# Altium schematic sheet main.SchDoc (part 3 of 3)
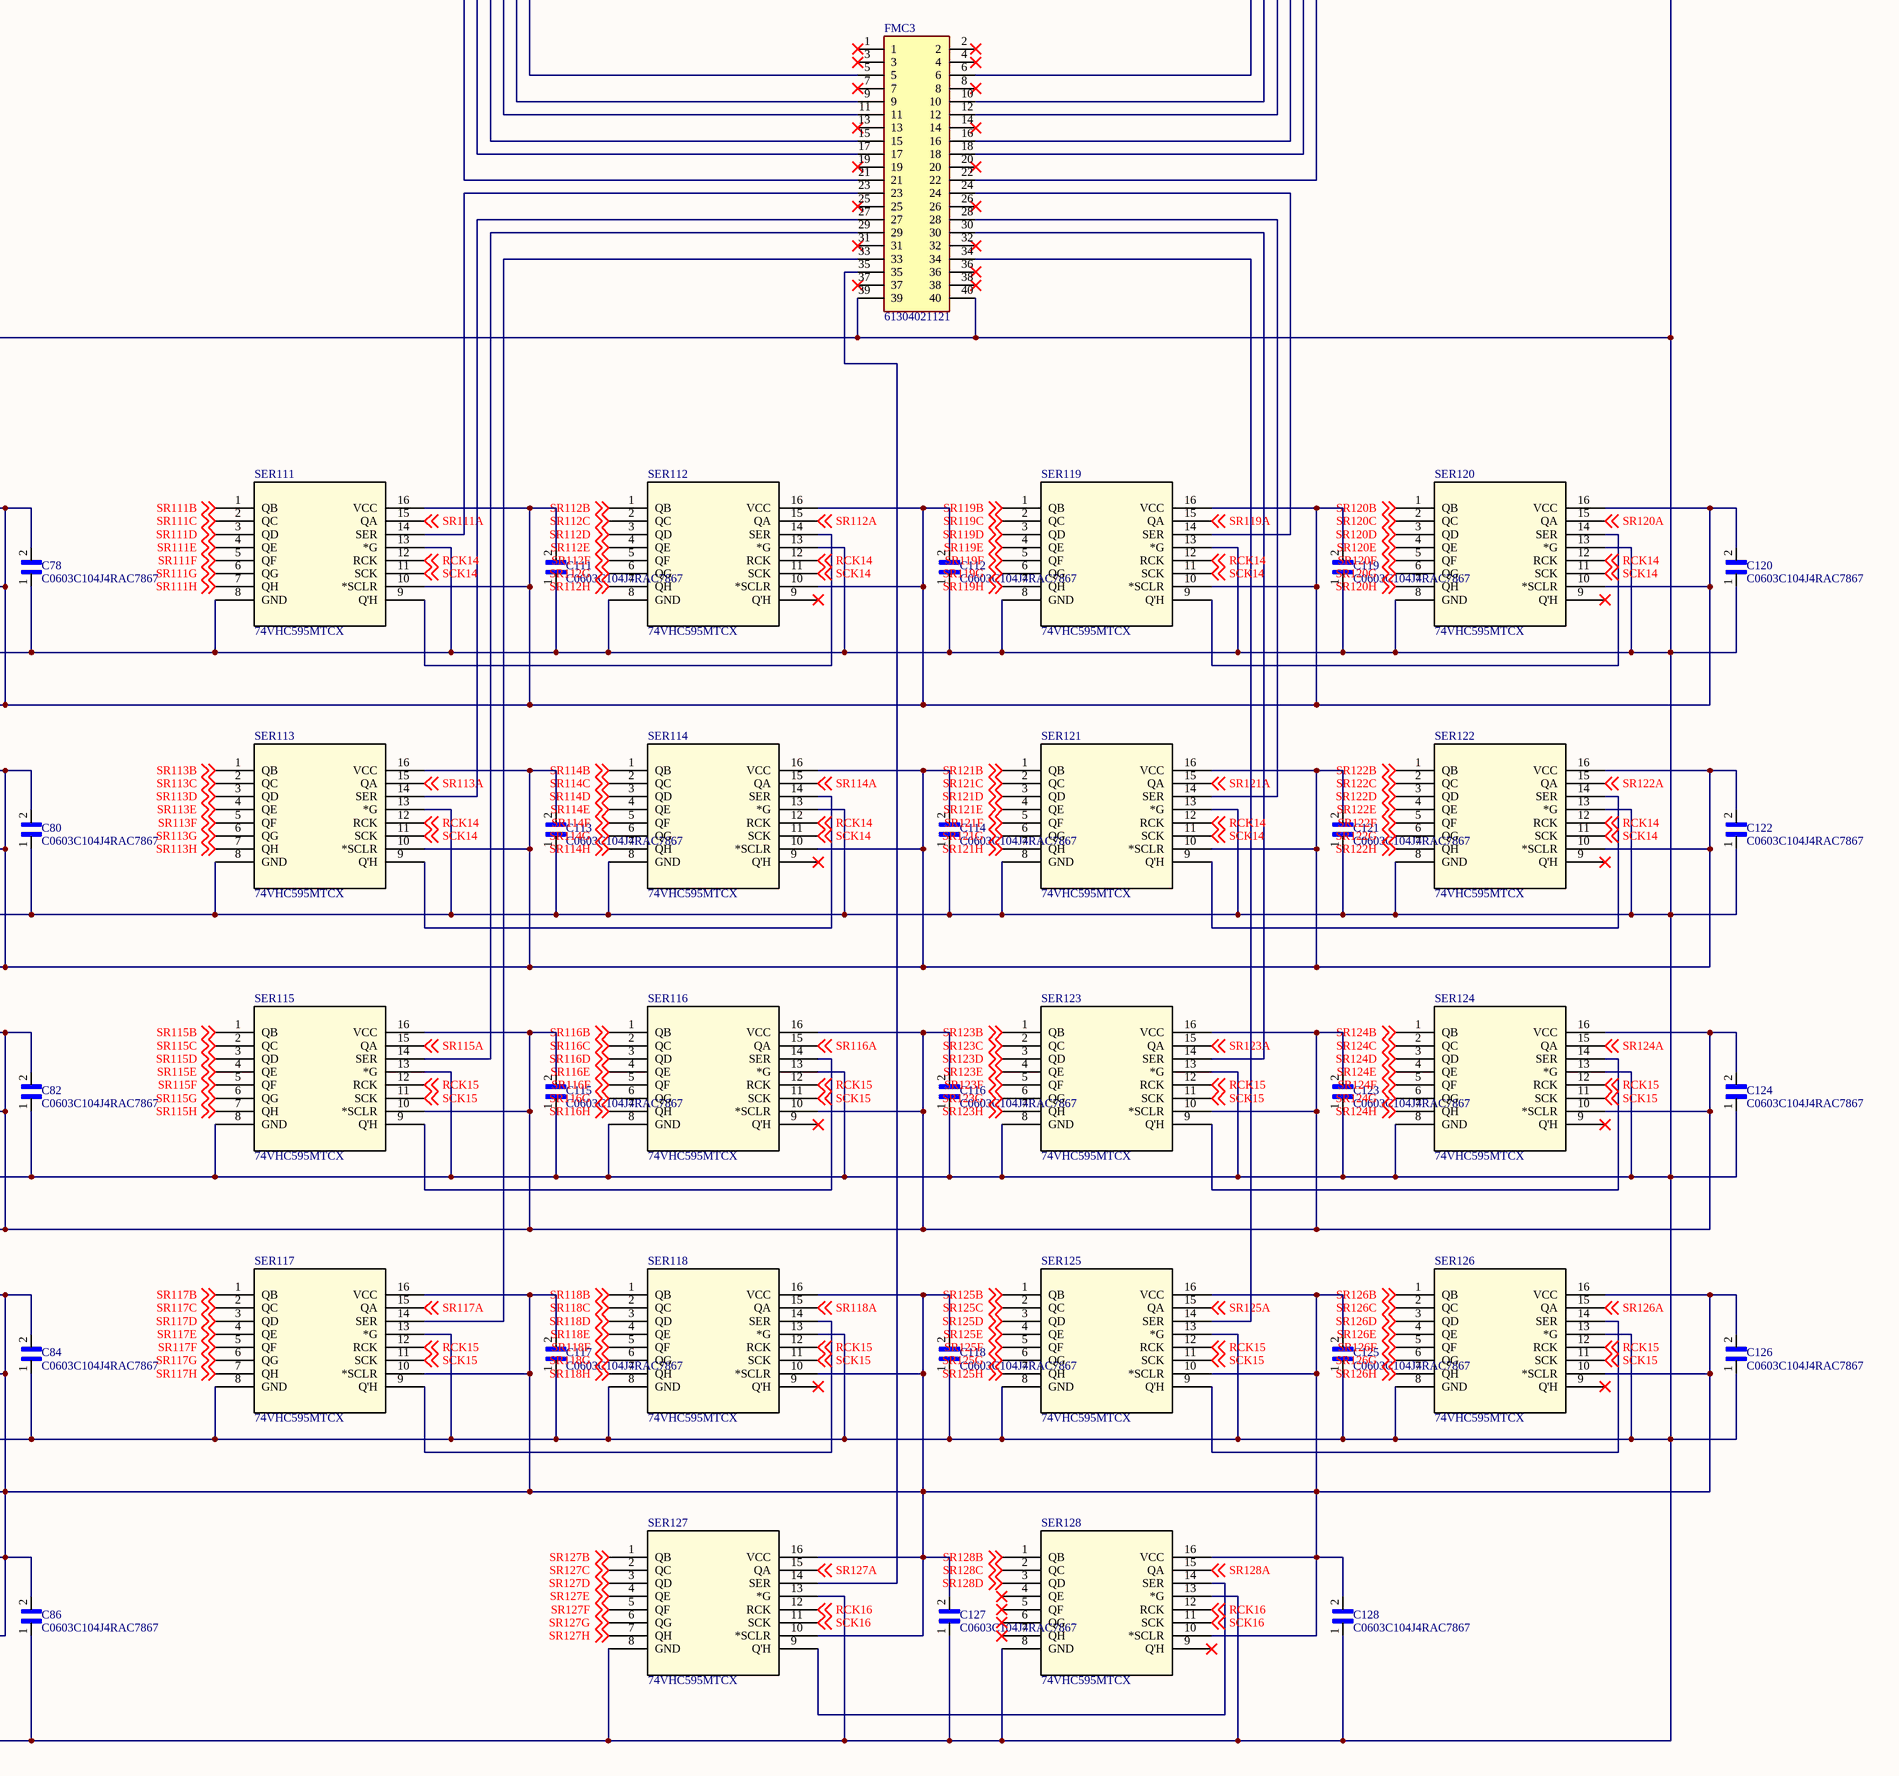
[diagram p7: main.SchDoc, bottom right]

## Nets (continued)
NetC11_2: C11.2 C12.2 C23.2 C24.2 C53.2 C54.2 C65.2 C66.2 C97.2 C98.2 C109.2 C110.2 Pmod3.2 SER11.10(*SCLR) SER11.16(VCC) SER12.10(*SCLR) SER12.16(VCC) SER23.10(*SCLR) SER23.16(VCC) SER24.10(*SCLR) SER24.16(VCC) SER53.10(*SCLR) SER53.16(VCC) SER54.10(*SCLR) SER54.16(VCC) SER65.10(*SCLR) SER65.16(VCC) SER66.10(*SCLR) SER66.16(VCC) SER97.10(*SCLR) SER97.16(VCC) SER98.10(*SCLR) SER98.16(VCC) SER109.10(*SCLR) SER109.16(VCC) SER110.10(*SCLR) SER110.16(VCC)
NetC25_2: C25.2 C26.2 C33.2 C34.2 C67.2 C68.2 C77.2 C78.2 C111.2 C112.2 C119.2 C120.2 Pmod4.1 SER25.10(*SCLR) SER25.16(VCC) SER26.10(*SCLR) SER26.16(VCC) SER33.10(*SCLR) SER33.16(VCC) SER34.10(*SCLR) SER34.16(VCC) SER67.10(*SCLR) SER67.16(VCC) SER68.10(*SCLR) SER68.16(VCC) SER77.10(*SCLR) SER77.16(VCC) SER78.10(*SCLR) SER78.16(VCC) SER111.10(*SCLR) SER111.16(VCC) SER112.10(*SCLR) SER112.16(VCC) SER119.10(*SCLR) SER119.16(VCC) SER120.10(*SCLR) SER120.16(VCC)
NetC27_2: C27.2 C28.2 C35.2 C36.2 C69.2 C70.2 C79.2 C80.2 C113.2 C114.2 C121.2 C122.2 Pmod4.2 SER27.10(*SCLR) SER27.16(VCC) SER28.10(*SCLR) SER28.16(VCC) SER35.10(*SCLR) SER35.16(VCC) SER36.10(*SCLR) SER36.16(VCC) SER69.10(*SCLR) SER69.16(VCC) SER70.10(*SCLR) SER70.16(VCC) SER79.10(*SCLR) SER79.16(VCC) SER80.10(*SCLR) SER80.16(VCC) SER113.10(*SCLR) SER113.16(VCC) SER114.10(*SCLR) SER114.16(VCC) SER121.10(*SCLR) SER121.16(VCC) SER122.10(*SCLR) SER122.16(VCC)
NetC29_2: C29.2 C30.2 C37.2 C38.2 C71.2 C72.2 C81.2 C82.2 C115.2 C116.2 C123.2 C124.2 Pmod5.1 SER29.10(*SCLR) SER29.16(VCC) SER30.10(*SCLR) SER30.16(VCC) SER37.10(*SCLR) SER37.16(VCC) SER38.10(*SCLR) SER38.16(VCC) SER71.10(*SCLR) SER71.16(VCC) SER72.10(*SCLR) SER72.16(VCC) SER81.10(*SCLR) SER81.16(VCC) SER82.10(*SCLR) SER82.16(VCC) SER115.10(*SCLR) SER115.16(VCC) SER116.10(*SCLR) SER116.16(VCC) SER123.10(*SCLR) SER123.16(VCC) SER124.10(*SCLR) SER124.16(VCC)
NetC31_2: C31.2 C32.2 C39.2 C40.2 C41.2 C42.2 C73.2 C74.2 C75.2 C76.2 C83.2 C84.2 C85.2 C86.2 C117.2 C118.2 C125.2 C126.2 C127.2 C128.2 Pmod5.2 SER31.10(*SCLR) SER31.16(VCC) SER32.10(*SCLR) SER32.16(VCC) SER39.10(*SCLR) SER39.16(VCC) SER40.10(*SCLR) SER40.16(VCC) SER41.10(*SCLR) SER41.16(VCC) SER42.10(*SCLR) SER42.16(VCC) SER73.10(*SCLR) SER73.16(VCC) SER74.10(*SCLR) SER74.16(VCC) SER75.10(*SCLR) SER75.16(VCC) SER76.10(*SCLR) SER76.16(VCC) SER83.10(*SCLR) SER83.16(VCC) SER84.10(*SCLR) SER84.16(VCC) SER85.10(*SCLR) SER85.16(VCC) SER86.10(*SCLR) SER86.16(VCC) SER117.10(*SCLR) SER117.16(VCC) SER118.10(*SCLR) SER118.16(VCC) SER125.10(*SCLR) SER125.16(VCC) SER126.10(*SCLR) SER126.16(VCC) SER127.10(*SCLR) SER127.16(VCC) SER128.10(*SCLR) SER128.16(VCC)
NetFMC1_5: FMC1.5 SER1.14(SER)
NetFMC1_6: FMC1.6 SER13.14(SER)
NetFMC1_9: FMC1.9 SER3.14(SER)
NetFMC1_10: FMC1.10 SER15.14(SER)
NetFMC1_12: FMC1.12 SER17.14(SER)
NetFMC1_15: FMC1.15 SER7.14(SER)
NetFMC1_16: FMC1.16 SER19.14(SER)
NetFMC1_17: FMC1.17 SER9.14(SER)
NetFMC1_18: FMC1.18 SER21.14(SER)
NetFMC1_21: FMC1.21 SER11.14(SER)
NetFMC1_22: FMC1.22 SER23.14(SER)
NetFMC1_23: FMC1.23 SER25.14(SER)
NetFMC1_24: FMC1.24 SER33.14(SER)
NetFMC1_27: FMC1.27 SER27.14(SER)
NetFMC1_28: FMC1.28 SER35.14(SER)
NetFMC1_29: FMC1.29 SER29.14(SER)
NetFMC1_30: FMC1.30 SER37.14(SER)
NetFMC1_33: FMC1.33 SER31.14(SER)
NetFMC1_34: FMC1.34 SER39.14(SER)
NetFMC1_36: FMC1.36 SER41.14(SER)
NetFMC2_3: FMC2.3 SER43.14(SER)
NetFMC2_4: FMC2.4 SER55.14(SER)
NetFMC2_5: FMC2.5 SER45.14(SER)
NetFMC2_6: FMC2.6 SER57.14(SER)
NetFMC2_10: FMC2.10 SER59.14(SER)
NetFMC2_11: FMC2.11 SER49.14(SER)
NetFMC2_12: FMC2.12 SER61.14(SER)
NetFMC2_15: FMC2.15 SER51.14(SER)
NetFMC2_16: FMC2.16 SER63.14(SER)
NetFMC2_17: FMC2.17 SER53.14(SER)
NetFMC2_18: FMC2.18 SER65.14(SER)
NetFMC2_21: FMC2.21 SER67.14(SER)
NetFMC2_22: FMC2.22 SER77.14(SER)
NetFMC2_23: FMC2.23 SER69.14(SER)
NetFMC2_24: FMC2.24 SER79.14(SER)
NetFMC2_27: FMC2.27 SER71.14(SER)
NetFMC2_28: FMC2.28 SER81.14(SER)
NetFMC2_29: FMC2.29 SER73.14(SER)
NetFMC2_30: FMC2.30 SER83.14(SER)
NetFMC2_33: FMC2.33 SER75.14(SER)
NetFMC2_34: FMC2.34 SER85.14(SER)
NetFMC3_5: FMC3.5 SER87.14(SER)
NetFMC3_6: FMC3.6 SER99.14(SER)
NetFMC3_9: FMC3.9 SER89.14(SER)
NetFMC3_10: FMC3.10 SER101.14(SER)
NetFMC3_12: FMC3.12 SER103.14(SER)
NetFMC3_15: FMC3.15 SER93.14(SER)
NetFMC3_16: FMC3.16 SER105.14(SER)
NetFMC3_17: FMC3.17 SER95.14(SER)
NetFMC3_18: FMC3.18 SER107.14(SER)
NetFMC3_21: FMC3.21 SER97.14(SER)
NetFMC3_22: FMC3.22 SER109.14(SER)
NetFMC3_23: FMC3.23 SER111.14(SER)
NetFMC3_24: FMC3.24 SER119.14(SER)
NetFMC3_27: FMC3.27 SER113.14(SER)
NetFMC3_28: FMC3.28 SER121.14(SER)
NetFMC3_29: FMC3.29 SER115.14(SER)
NetFMC3_30: FMC3.30 SER123.14(SER)
NetFMC3_33: FMC3.33 SER117.14(SER)
NetFMC3_34: FMC3.34 SER125.14(SER)
NetFMC3_35: FMC3.35 SER127.14(SER)
NetPmod1_5: Pmod1.5 RM1.2
NetPmod1_6: Pmod1.6 RM5.1
NetPmod1_7: Pmod1.7 RM2.2
NetPmod1_8: Pmod1.8 RM6.1
NetPmod1_9: Pmod1.9 RM3.2
NetPmod1_10: Pmod1.10 RM7.1
NetPmod1_11: Pmod1.11 RM4.2
NetPmod1_12: Pmod1.12 RM8.1
NetPmod2_5: Pmod2.5 RM9.2
NetPmod2_6: Pmod2.6 RM13.1
NetPmod2_7: Pmod2.7 RM10.2
NetPmod2_8: Pmod2.8 RM14.1
NetPmod2_9: Pmod2.9 RM11.2
NetPmod2_10: Pmod2.10 RM15.1
NetPmod2_11: Pmod2.11 RM12.2
NetPmod2_12: Pmod2.12 RM16.1
NetPmod3_5: Pmod3.5 RM17.2
NetPmod3_6: Pmod3.6 RM21.1
NetPmod3_7: Pmod3.7 RM18.2
NetPmod3_8: Pmod3.8 RM22.1
NetPmod3_9: Pmod3.9 RM19.2
NetPmod3_10: Pmod3.10 RM23.1
NetPmod3_11: Pmod3.11 RM20.2
NetPmod3_12: Pmod3.12 RM24.1
NetPmod4_5: Pmod4.5 RM25.2
NetPmod4_7: Pmod4.7 RM26.2
NetPmod4_9: Pmod4.9 RM27.2
NetPmod4_11: Pmod4.11 RM28.2
NetPmod5_5: Pmod5.5 RM29.2
NetPmod5_7: Pmod5.7 RM30.2
NetPmod5_9: Pmod5.9 RM31.2
NetPmod5_11: Pmod5.11 RM32.2
NetSER1_9: SER1.9(Q'H) SER2.14(SER)
NetSER3_9: SER3.9(Q'H) SER4.14(SER)
NetSER5_9: SER5.9(Q'H) SER6.14(SER)
NetSER7_9: SER7.9(Q'H) SER8.14(SER)
NetSER9_9: SER9.9(Q'H) SER10.14(SER)
NetSER11_9: SER11.9(Q'H) SER12.14(SER)
NetSER13_9: SER13.9(Q'H) SER14.14(SER)
NetSER15_9: SER15.9(Q'H) SER16.14(SER)
NetSER17_9: SER17.9(Q'H) SER18.14(SER)
NetSER19_9: SER19.9(Q'H) SER20.14(SER)
NetSER21_9: SER21.9(Q'H) SER22.14(SER)
NetSER23_9: SER23.9(Q'H) SER24.14(SER)
NetSER25_9: SER25.9(Q'H) SER26.14(SER)
NetSER27_9: SER27.9(Q'H) SER28.14(SER)
NetSER29_9: SER29.9(Q'H) SER30.14(SER)
NetSER31_9: SER31.9(Q'H) SER32.14(SER)
NetSER33_9: SER33.9(Q'H) SER34.14(SER)
NetSER35_9: SER35.9(Q'H) SER36.14(SER)
NetSER37_9: SER37.9(Q'H) SER38.14(SER)
NetSER39_9: SER39.9(Q'H) SER40.14(SER)
NetSER41_9: SER41.9(Q'H) SER42.14(SER)
NetSER43_9: SER43.9(Q'H) SER44.14(SER)
NetSER45_9: SER45.9(Q'H) SER46.14(SER)
NetSER47_9: SER47.9(Q'H) SER48.14(SER)
NetSER49_9: SER49.9(Q'H) SER50.14(SER)
NetSER51_9: SER51.9(Q'H) SER52.14(SER)
NetSER53_9: SER53.9(Q'H) SER54.14(SER)
NetSER55_9: SER55.9(Q'H) SER56.14(SER)
NetSER57_9: SER57.9(Q'H) SER58.14(SER)
NetSER59_9: SER59.9(Q'H) SER60.14(SER)
NetSER61_9: SER61.9(Q'H) SER62.14(SER)
NetSER63_9: SER63.9(Q'H) SER64.14(SER)
NetSER65_9: SER65.9(Q'H) SER66.14(SER)
NetSER67_9: SER67.9(Q'H) SER68.14(SER)
NetSER69_9: SER69.9(Q'H) SER70.14(SER)
NetSER71_9: SER71.9(Q'H) SER72.14(SER)
NetSER73_9: SER73.9(Q'H) SER74.14(SER)
NetSER75_9: SER75.9(Q'H) SER76.14(SER)
NetSER77_9: SER77.9(Q'H) SER78.14(SER)
NetSER79_9: SER79.9(Q'H) SER80.14(SER)
NetSER81_9: SER81.9(Q'H) SER82.14(SER)
NetSER83_9: SER83.9(Q'H) SER84.14(SER)
NetSER85_9: SER85.9(Q'H) SER86.14(SER)
NetSER87_9: SER87.9(Q'H) SER88.14(SER)
NetSER89_9: SER89.9(Q'H) SER90.14(SER)
NetSER91_9: SER91.9(Q'H) SER92.14(SER)
NetSER93_9: SER93.9(Q'H) SER94.14(SER)
NetSER95_9: SER95.9(Q'H) SER96.14(SER)
NetSER97_9: SER97.9(Q'H) SER98.14(SER)
NetSER99_9: SER99.9(Q'H) SER100.14(SER)
NetSER101_9: SER101.9(Q'H) SER102.14(SER)
NetSER103_9: SER103.9(Q'H) SER104.14(SER)
NetSER105_9: SER105.9(Q'H) SER106.14(SER)
NetSER107_9: SER107.9(Q'H) SER108.14(SER)
NetSER109_9: SER109.9(Q'H) SER110.14(SER)
NetSER111_9: SER111.9(Q'H) SER112.14(SER)
NetSER113_9: SER113.9(Q'H) SER114.14(SER)
NetSER115_9: SER115.9(Q'H) SER116.14(SER)
NetSER117_9: SER117.9(Q'H) SER118.14(SER)
NetSER119_9: SER119.9(Q'H) SER120.14(SER)
NetSER121_9: SER121.9(Q'H) SER122.14(SER)
NetSER123_9: SER123.9(Q'H) SER124.14(SER)
NetSER125_9: SER125.9(Q'H) SER126.14(SER)
NetSER127_9: SER127.9(Q'H) SER128.14(SER)

Not connected (* = marked no-connect by the designer): FMC1 1* 2* 3* 4* 7* 8* 13* 14* 19* 20* 25* 26* 31* 32* 35* 37* 38*; FMC2 1* 2* 7* 8* 13* 14* 19* 20* 25* 26* 31* 32* 35* 36* 37* 38*; FMC3 1* 2* 3* 4* 7* 8* 13* 14* 19* 20* 25* 26* 31* 32* 36* 37* 38*; Pmod4 6* 8* 10* 12*; Pmod5 6* 8* 10* 12*; SER2 9(Q'H)*; SER4 9(Q'H)*; SER6 9(Q'H)*; SER8 9(Q'H)*; SER10 9(Q'H)*; SER12 9(Q'H)*; SER14 9(Q'H)*; SER16 9(Q'H)*; SER18 9(Q'H)*; SER20 9(Q'H)*; SER22 9(Q'H)*; SER24 9(Q'H)*; SER26 9(Q'H)*; SER28 9(Q'H)*; SER30 9(Q'H)*; SER32 9(Q'H)*; SER34 9(Q'H)*; SER36 9(Q'H)*; SER38 9(Q'H)*; SER40 9(Q'H)*; SER42 9(Q'H)*; SER44 9(Q'H)*; SER46 9(Q'H)*; SER48 9(Q'H)*; SER50 9(Q'H)*; SER52 9(Q'H)*; SER54 9(Q'H)*; SER56 9(Q'H)*; SER58 9(Q'H)*; SER60 9(Q'H)*; SER62 9(Q'H)*; SER64 9(Q'H)*; SER66 9(Q'H)*; SER68 9(Q'H)*; SER70 9(Q'H)*; SER72 9(Q'H)*; SER74 9(Q'H)*; SER76 9(Q'H)*; SER78 9(Q'H)*; SER80 9(Q'H)*; SER82 9(Q'H)*; SER84 9(Q'H)*; SER86 9(Q'H)*; SER88 9(Q'H)*; SER90 9(Q'H)*; SER92 9(Q'H)*; SER94 9(Q'H)*; SER96 9(Q'H)*; SER98 9(Q'H)*; SER100 9(Q'H)*; SER102 9(Q'H)*; SER104 9(Q'H)*; SER106 9(Q'H)*; SER108 9(Q'H)*; SER110 9(Q'H)*; SER112 9(Q'H)*; SER114 9(Q'H)*; SER116 9(Q'H)*; SER118 9(Q'H)*; SER120 9(Q'H)*; SER122 9(Q'H)*; SER124 9(Q'H)*; SER126 9(Q'H)*; SER128 4(QE)* 5(QF)* 6(QG)* 7(QH)* 9(Q'H)*

## Library data of the parts
C1-C128 = C0603C104J4RAC7867: Cap Ceramic 0.1uF 16V X7R 5% SMD 1.6 x 0.8 mm 125 C Paper T/R; MF: KEMET; Price: None; Availability: In Stock; Value: *; MP: C0603C104J4RAC7867; Check_prices: https://www.snapeda.com/parts/C0603C104J4RAC7867/KEMET/view-part/?ref=eda; Purchase-URL: https://pricing.snapeda.com/search/part/C0603C104J4RAC7867/?ref=eda; SnapEDA_Link: https://www.snapeda.com/parts/C0603C104J4RAC7867/KEMET/view-part/?ref=snap; Package: 0603 KEMET
FMC1-FMC3 = 61304021121: Connector; Manufacturer_Name: Wurth Elektronik; Datasheet Link: https://katalog.we-online.com/em/datasheet/6130xx21121.pdf; Height: 8.69mm; Manufacturer_Part_Number: 61304021121; Mouser Part Number: 710-61304021121; Mouser Price/Stock: https://www.mouser.co.uk/ProductDetail/Wurth-Elektronik/61304021121?qs=PhR8RmCirEYWKI5WqdDUyg%3D%3D
Header45-Header50 = 5-146130-1: 2*2 Header
Pmod1-Pmod5 = PPPC062LFBN-RC: Connector; Manufacturer_Name: Sullins; Datasheet Link: https://drawings-pdf.s3.amazonaws.com/10492.pdf; Height: 8.5mm; Manufacturer_Part_Number: PPPC062LFBN-RC
RM1-RM32 = RNCF0603AKT10R0: 10Ohm; Mfr_Name: Stackpole International; Copyright: Copyright (C) 2023 Ultra Librarian. All rights reserved.; Manufacturer_Part_Number: RNCF0603AKT10R0; RefDes: RefDes; Type: DEV
SER1-SER128 = 74VHC595MTCX: No Description Available; Mfr_Name: onsemi; Copyright: Copyright (C) 2022 Ultra Librarian. All rights reserved.; Manufacturer_Part_Number: 74VHC595MTCX; Digi-Key_Part_Number_1: 74VHC595MTCXTR-ND; Digi-Key_Part_Number_2: 74VHC595MTCXCT-ND; Digi-Key_Part_Number_3: 74VHC595MTCXDKR-ND; RefDes: RefDes; Type: DEV